# Altium project 电压测量前端(双电源).PrjPcb
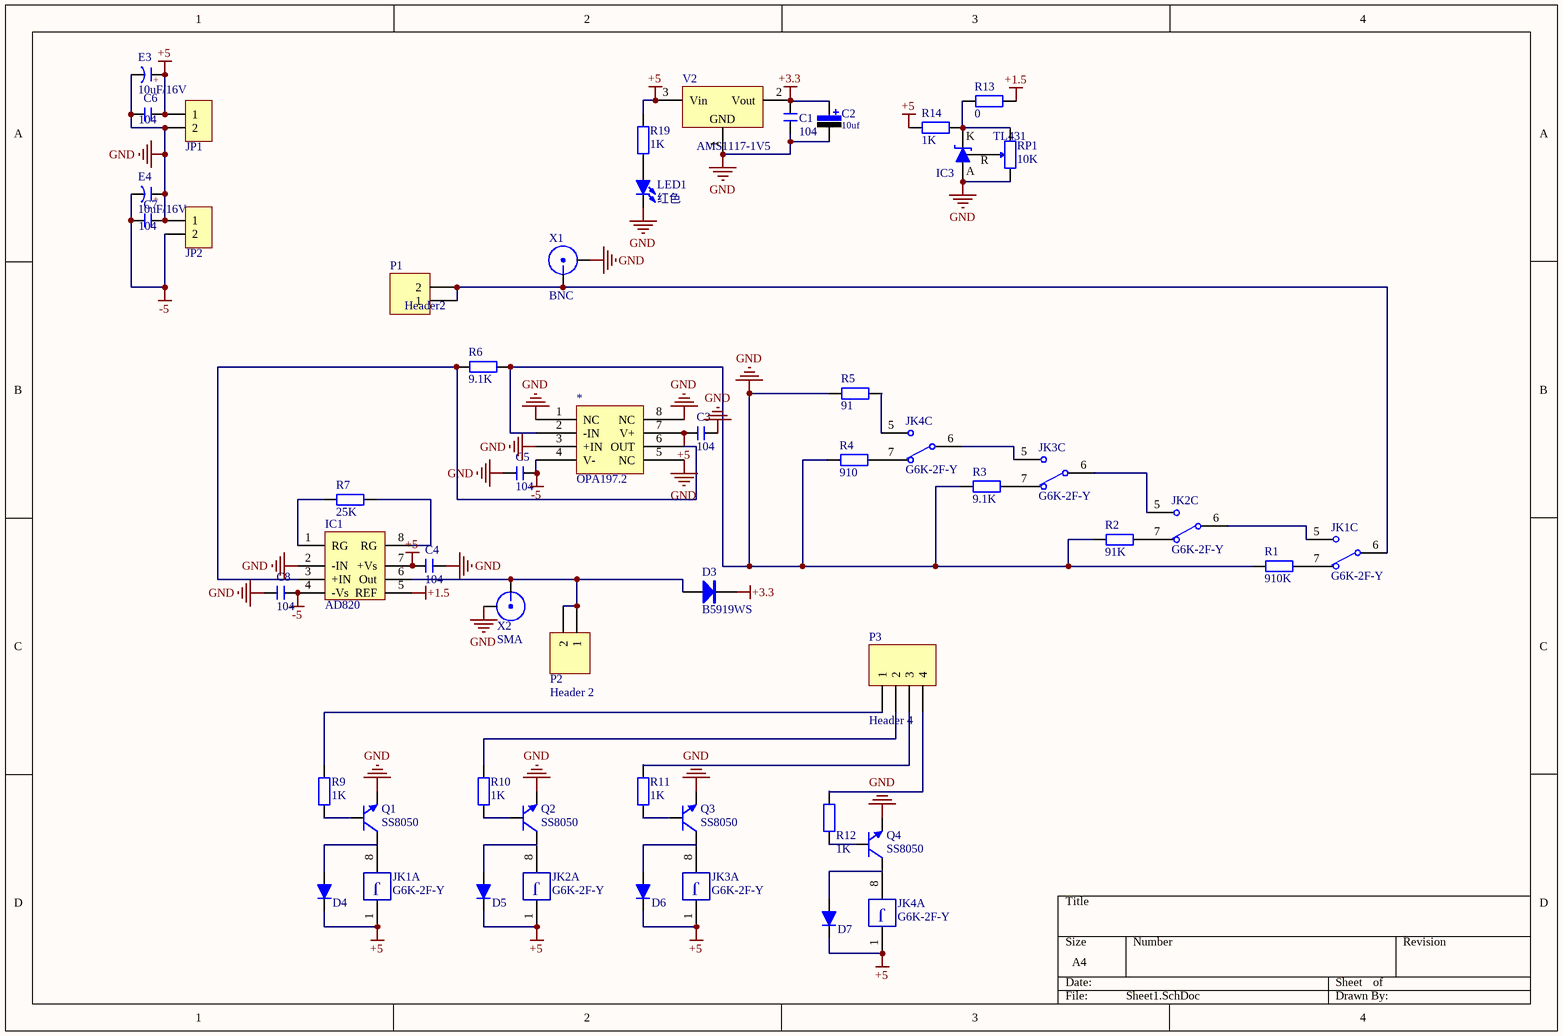
[diagram p0: Sheet1.SchDoc]
1 sheet, 50 parts. Net scope: global (net labels, ports and power ports of the same name join across sheets).
Board file: PCB1.PcbDoc

## Sheet Sheet1.SchDoc
size A4

### Parts
*  OPA197.2  [SOP-8]
C1  104  [C 0603_L]
C2  value 10uf  [C-DIP-5]  (hidden comment: C)
C3  104  [C 0603_L]
C4  104  [C 0603_L]
C5  104  [C 0603_L]
C6  104  [C 0603_L]
C7  104  [C 0603_L]
C8  104  [C 0603_L]
D3  B5919WS  [SMA]
D4  D  [D-SMA]  (value not drawn)
D5  D  [D-SMA]  (value not drawn)
D6  D  [D-SMA]  (value not drawn)
D7  D  [D-SMA]  (value not drawn)
E3  10uF/16V  [CAP 2.5*5*11 - GD]
E4  10uF/16V  [CAP 2.0*5*11]
IC1  AD820  [SOP8_N]
IC3  TL431  [SOT23-3L]
JK1  G6K-2F-Y  [G6K-2F-Y]  (parts A,C of 3)
JK2  G6K-2F-Y  [G6K-2F-Y]  (parts A,C of 3)
JK3  G6K-2F-Y  [G6K-2F-Y]  (parts A,C of 3)
JK4  G6K-2F-Y  [G6K-2F-Y]  (parts A,C of 3)
JP1  HDR-1X2  [VH3.96-LI-2P]  (value not drawn)
JP2  HDR-1X2  [VH3.96-LI-2P]  (value not drawn)
LED1  红色  [LED 0805B]
P1  Header2  [HDR1X2]
P2  Header 2  [HDR1X2]
P3  Header 4  [HDR1X4]
Q1  SS8050  [SOT23-3N]
Q2  SS8050  [SOT23-3N]
Q3  SS8050  [SOT23-3N]
Q4  SS8050  [SOT23-3N]
R1  910K  [R 0603_L]
R2  91K  [R 0603_L]
R3  9.1K  [R 0603_L]
R4  910  [R 0603_L]
R5  91  [R 0603_L]
R6  9.1K  [R 0603_L]
R7  25K  [R 0805_L]
R9  1K  [R 0603_L]
R10  1K  [R 0603_L]
R11  1K  [R 0603_L]
R12  1K  [R 0603_L]
R13  0  [R 0603_L]
R14  1K  [R 0603_L]
R19  1K  [R 0603_L]
RP1  10K  [3296W]
V2  AMS1117-1V5  [SOT223_L]
X1  BNC  [BNC]
X2  SMA  [SMA1]

### Nets
+1.5: IC1.5(REF) R13.1
+3.3: C1.1 C2.1 D3.2(K) V2.2(Vout)
+5: *.7(V+) C3.2 C4.2 C6.2 D4.2 D5.2 D6.2 D7.2 E3.1(A) IC1.7(+Vs) JK1.1 JK2.1 JK3.1 JK4.1 JP1.1 R14.2 R19.1 V2.3(Vin)
-5: *.4(V-) C5.1 C7.1 C8.2 E4.2(K) IC1.4(-Vs) JP2.2
GND: *.1(NC) *.2(-IN) *.3(+IN) *.5(NC) *.8(NC) C1.2 C2.2 C3.1 C4.1 C5.2 C6.1 C7.2 C8.1 E3.2(K) E4.1(A) IC1.2(-IN) IC3.3(A) JP1.2 JP2.1 LED1.2(K) Q1.2(E) Q2.2(E) Q3.2(E) Q4.2(E) R1.1 R2.1 R3.1 R4.1 R5.1 R6.2 RP1.1 V2.1(GND) X1.1 X2.2
Net*_6: *.6(OUT) IC1.3(+IN) R6.1
NetD3_1: D3.1(A) IC1.6(Out) P2.1 P2.2 X2.1
NetD4_1: D4.1 Q1.3(C)
NetD5_1: D5.1 Q2.3(C)
NetD6_1: D6.1 Q3.3(C)
NetD7_1: D7.1 Q4.3(C)
NetIC1_1: IC1.1(RG) R7.1
NetIC1_8: IC1.8(RG) R7.2
NetIC3_1: IC3.1(R) RP1.2
NetIC3_2: IC3.2(K) R13.2 R14.1 RP1.3
NetJK1_5: JK1.5 JK2.6
NetJK1_6: JK1.6 P1.1 P1.2 X1.2
NetJK1_7: JK1.7 R1.2
NetJK2_5: JK2.5 JK3.6
NetJK2_7: JK2.7 R2.2
NetJK3_5: JK3.5 JK4.6
NetJK3_7: JK3.7 R3.2
NetJK4_5: JK4.5 R5.2
NetJK4_7: JK4.7 R4.2
NetLED1_1: LED1.1(A) R19.2
NetP3_1: P3.1 R9.2
NetP3_2: P3.2 R10.2
NetP3_3: P3.3 R11.2
NetP3_4: P3.4 R12.2
NetQ1_1: Q1.1(B) R9.1
NetQ2_1: Q2.1(B) R10.1
NetQ3_1: Q3.1(B) R11.1
NetQ4_1: Q4.1(B) R12.1

Not connected (* = marked no-connect by the designer): JK1 8; JK2 8; JK3 8; JK4 8

### Notes on the sheet
- (in symbol C-CAP) +
- (in symbol G6K-2F-Y, part A) J

### Library data of the parts
C1 C3-C8 = C: 无极性贴片电容; 版权归属: 源创客; BOM名称: 无极性贴片电容; 学习资源: www.ooocke.com
C2 = Cap-Pol-ER: 极性直插电解电容
D3 = 1N5819: 肖特基二极管; 版权归属: 源创客; 属性: 40V/2A; BOM名称: 肖特基二极管; 学习资源: www.ooocke.com
D4-D7 = Diode: 二极管
E3 E4 = C-CAP: 直插电解电容; 版权归属: 源创客; BOM名称: 直插电解电容; 学习资源: www.ooocke.com
IC1 = AD620: 仪表放大器
IC3 = TL431_SMD: 可调基准稳压芯片; 版权归属: 源创客; BOM名称: 可调基准稳压芯片; 学习资源: www.ooocke.com
JK1-JK4 = G6K-2F-Y: 两组转换-信号型; BOM名称: 两组信号继电器; 版权归属: 源创客; 学习资源: www.ooocke.com
JP1 JP2 = Header 2: 2P接插件; 版权归属: 源创客; BOM名称: 2P接插件; 学习资源: www.ooocke.com
LED1 = LED-SMD: 贴片LED; 版权归属: 源创客; BOM名称: 贴片LED; 学习资源: www.ooocke.com
P1 P2 = Header 2: Header, 2-Pin; LatestRevisionDate: 17-Jul-2002; LatestRevisionNote: Re-released for DXP Platform.; Publisher: Altium Limited
P3 = Header 4: Header, 4-Pin; LatestRevisionDate: 17-Jul-2002; LatestRevisionNote: Re-released for DXP Platform.; Publisher: Altium Limited
Q1-Q4 = 8050-SMD: 高频放大-NPN型; 版权归属: 源创客; 属性: 40V 1.5A 1W 100MHZ; BOM名称: 高频放大-NPN型; 学习资源: www.ooocke.com
R1-R7 R9-R14 R19 = R: 贴片电阻; 版权归属: 源创客; BOM名称: 贴片电阻; 学习资源: www.ooocke.com
RP1 = RP-ID: 插件单联电位器; BOM名称: 插件电位器; 版权归属: 源创客; 学习资源: www.ooocke.com
V2 = AMS1117: 三端稳压芯片; BOM名称: 稳压芯片; 版权归属: 源创客; 学习资源: www.ooocke.com